# Altium project PCB_Project1.PrjPCB
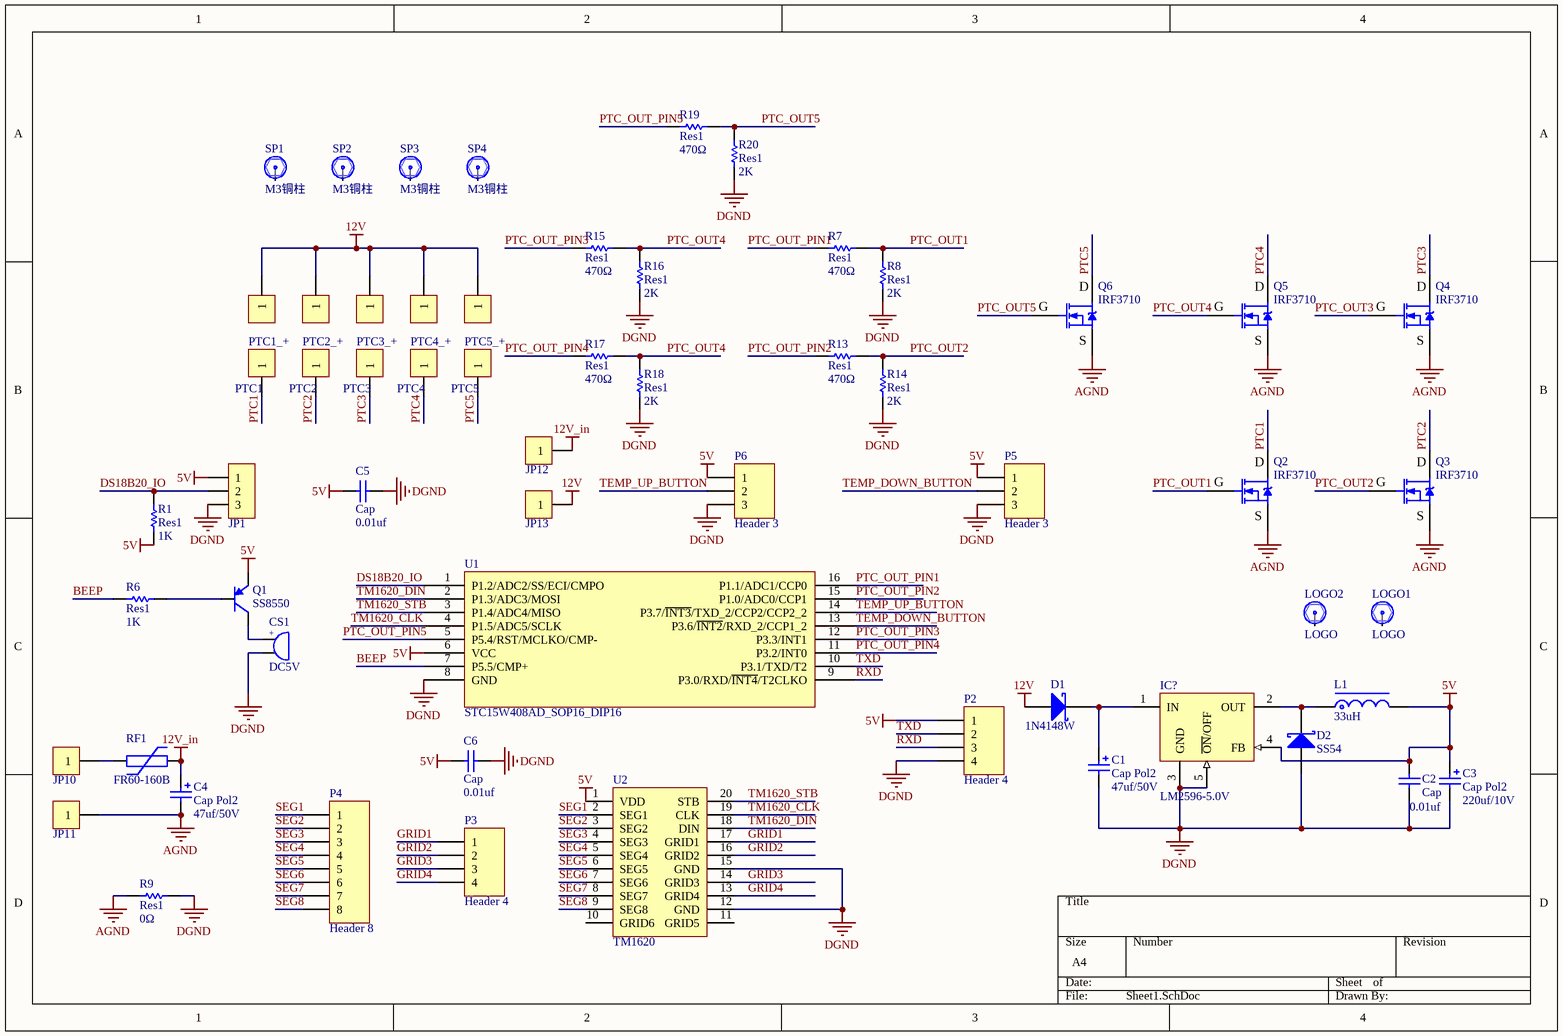
[diagram p0: Sheet1.SchDoc]
1 sheet, 59 parts. Net scope: global (net labels, ports and power ports of the same name join across sheets).
Board file: PCB1.PcbDoc

## Sheet Sheet1.SchDoc
size A4

### Parts
C1  Cap Pol2  value 47uf/50V  [CAP6.3]
C2  Cap  value 0.01uf  [0603C]
C3  Cap Pol2  value 220uf/10V  [CAP6.3]
C4  Cap Pol2  value 47uf/50V  [CAP6.3]
C5  Cap  value 0.01uf  [0603C]
C6  Cap  value 0.01uf  [0603C]
CS1  DC5V  [BEEP 5x9x5.5]
D1  1N4148W  [SOD-123]
D2  SS54  [SOD-123]
IC?  LM2596-5.0V  [TO220-5A]
JP1  HDR-1X3  [XH2.54-LI-3P]  (value not drawn)
JP10  冷压插片  [TEST 2.6]  (value not drawn)
JP11  冷压插片  [TEST 2.6]  (value not drawn)
JP12  冷压插片  [TEST 2.6]  (value not drawn)
JP13  冷压插片  [TEST 2.6]  (value not drawn)
L1  33uH  [CD104]
LOGO1  LOGO  [ICO3]
LOGO2  LOGO  [ICO1]
P2  Header 4  [XH2.54-LI-4P]
P3  Header 4  [XH2.54-LI-4P]
P4  Header 8  [XH2.54-LI-8P]
P5  Header 3  [XH2.54-LI-3P]
P6  Header 3  [XH2.54-LI-3P]
PTC1  冷压插片  [TEST 2.6]  (value not drawn)
PTC1_+  冷压插片  [TEST 2.6]  (value not drawn)
PTC2  冷压插片  [TEST 2.6]  (value not drawn)
PTC2_+  冷压插片  [TEST 2.6]  (value not drawn)
PTC3  冷压插片  [TEST 2.6]  (value not drawn)
PTC3_+  冷压插片  [TEST 2.6]  (value not drawn)
PTC4  冷压插片  [TEST 2.6]  (value not drawn)
PTC4_+  冷压插片  [TEST 2.6]  (value not drawn)
PTC5  冷压插片  [TEST 2.6]  (value not drawn)
PTC5_+  冷压插片  [TEST 2.6]  (value not drawn)
Q1  SS8550  [SOT23-3N]
Q2  IRF3710  [TO252]
Q3  IRF3710  [TO252]
Q4  IRF3710  [TO252]
Q5  IRF3710  [TO252]
Q6  IRF3710  [TO252]
R1  Res1  value 1K  [0603R]
R6  Res1  value 1K  [0603R]
R7  Res1  value 470Ω  [0603R]
R8  Res1  value 2K  [0603R]
R9  Res1  value 0Ω  [0805R]
R13  Res1  value 470Ω  [0603R]
R14  Res1  value 2K  [0603R]
R15  Res1  value 470Ω  [0603R]
R16  Res1  value 2K  [0603R]
R17  Res1  value 470Ω  [0603R]
R18  Res1  value 2K  [0603R]
R19  Res1  value 470Ω  [0603R]
R20  Res1  value 2K  [0603R]
RF1  FR60-160B  [FR60-160B]
SP1  M3铜柱  [M3x4_L]
SP2  M3铜柱  [M3x4_L]
SP3  M3铜柱  [M3x4_L]
SP4  M3铜柱  [M3x4_L]
U1  STC15W408AD_SOP16_DIP16  [SOP16]
U2  TM1620  [SOP20]

### Nets
5V: C2.2 C3.1 C5.1 C6.1 IC?.4(FB) JP1.1 L1.2 P2.1 P5.1 P6.1 Q1.2(E) R1.1 U1.6(VCC) U2.1(VDD)
12V: D1.1(A) JP13.1 PTC1_+.1 PTC2_+.1 PTC3_+.1 PTC4_+.1 PTC5_+.1
12V_in: C4.1 JP12.1 RF1.2
AGND: C4.2 JP11.1 Q2.3(S) Q3.3(S) Q4.3(S) Q5.3(S) Q6.3(S) R9.1
DGND: C1.2 C2.1 C3.2 C5.2 C6.2 CS1.2 D2.1(A) IC?.3(GND) IC?.5(~{ON}/OFF) JP1.3 P2.4 P5.3 P6.3 R8.1 R9.2 R14.1 R16.1 R18.1 R20.1 U1.8(GND) U2.12(GND) U2.15(GND)
BEEP: R6.1 U1.7(P5.5/CMP+)
DS18B20_IO: JP1.2 R1.2 U1.1(P1.2/ADC2/SS/ECI/CMPO)
GRID1: P3.1 U2.17(GRID1)
GRID2: P3.2 U2.16(GRID2)
GRID3: P3.3 U2.14(GRID3)
GRID4: P3.4 U2.13(GRID4)
PTC1: PTC1.1 Q2.2(D)
PTC2: PTC2.1 Q3.2(D)
PTC3: PTC3.1 Q4.2(D)
PTC4: PTC4.1 Q5.2(D)
PTC5: PTC5.1 Q6.2(D)
PTC_OUT1: Q2.1(G) R7.2 R8.2
PTC_OUT2: Q3.1(G) R13.2 R14.2
PTC_OUT3: Q4.1(G)
PTC_OUT4: Q5.1(G) R15.2 R16.2 R17.2 R18.2
PTC_OUT5: Q6.1(G) R19.2 R20.2
PTC_OUT_PIN1: R7.1 U1.16(P1.1/ADC1/CCP0)
PTC_OUT_PIN2: R13.1 U1.15(P1.0/ADC0/CCP1)
PTC_OUT_PIN3: R15.1 U1.12(P3.3/INT1)
PTC_OUT_PIN4: R17.1 U1.11(P3.2/INT0)
PTC_OUT_PIN5: R19.1 U1.5(P5.4/RST/MCLKO/CMP-)
RXD: P2.3 U1.9(P3.0/RXD/~{INT4}/T2CLKO)
SEG1: P4.1 U2.2(SEG1)
SEG2: P4.2 U2.3(SEG2)
SEG3: P4.3 U2.4(SEG3)
SEG4: P4.4 U2.5(SEG4)
SEG5: P4.5 U2.6(SEG5)
SEG6: P4.6 U2.7(SEG6)
SEG7: P4.7 U2.8(SEG7)
SEG8: P4.8 U2.9(SEG8)
TEMP_DOWN_BUTTON: P5.2 U1.13(P3.6/~{INT2}/RXD_2/CCP1_2)
TEMP_UP_BUTTON: P6.2 U1.14(P3.7/~{INT3}/TXD_2/CCP2/CCP2_2)
TM1620_CLK: U1.4(P1.5/ADC5/SCLK) U2.19(CLK)
TM1620_DIN: U1.2(P1.3/ADC3/MOSI) U2.18(DIN)
TM1620_STB: U1.3(P1.4/ADC4/MISO) U2.20(STB)
TXD: P2.2 U1.10(P3.1/TXD/T2)
NetC1_1: C1.1 D1.2(K) IC?.1(IN)
NetCS1_1: CS1.1 Q1.3(C)
NetD2_2: D2.2(K) IC?.2(OUT) L1.1
NetJP10_1: JP10.1 RF1.1
NetQ1_1: Q1.1(B) R6.2

Not connected (* = marked no-connect by the designer): LOGO1 1; LOGO2 1; SP1 1; SP2 1; SP3 1; SP4 1; U2 10(GRID6) 11(GRID5)

### Notes on the sheet
- (in symbol BEEP) +

### Library data of the parts
C1 C3 C4 = Cap Pol2: Polarized Capacitor (Axial); Published: 8-Jun-2000; LatestRevisionDate: 17-Jul-2002; LatestRevisionNote: Re-released for DXP Platform.; PackageReference: POLAR0.8; Publisher: Altium Limited; PackageDescription: Polarized Capacitor; 2 Leads
C2 C5 C6 = Cap: Capacitor; Published: 8-Jun-2000; LatestRevisionDate: 17-Jul-2002; LatestRevisionNote: Re-released for DXP Platform.; PackageReference: RAD-0.3; Publisher: Altium Limited; PackageDescription: Radial Cap, Thru-Hole; 2 Leads; 0.3 in Pin Spacing
CS1 = BEEP: 蜂鸣器; 版权归属: 源创客; BOM名称: 蜂鸣器; 学习资源: www.ooocke.com
D1 D2 = D Schottky: Schottky Diode; Published: 8-Jun-2000; LatestRevisionDate: 17-Jul-2002; LatestRevisionNote: Re-released for DXP Platform.; PackageReference: SMB; Publisher: Altium Limited; PackageDescription: DO-214-AA/SMB; 2 C-Bend Leads; Body 5.3 x 3.6 mm, inc. leads (LxW); Code_JEDEC: DO-214-AA
IC? = LM2596-5.0: DC降压芯片; BOM名称: DC稳压芯片; 版权归属: 源创客; 学习资源: www.ooocke.com
JP1 = Header 3: 3P接插件; 版权归属: 源创客; BOM名称: 3P接插件; 学习资源: www.ooocke.com
JP10-JP13 PTC1 PTC1_+ PTC2 PTC2_+ PTC3 PTC3_+ PTC4 PTC4_+ PTC5 PTC5_+ = 冷压插片: BOM名称: 10P接插件; 版权归属: 源创客; 学习资源: www.ooocke.com
L1 = L-CD: 贴片功率电感; BOM名称: 功率电感; 版权归属: 源创客; 学习资源: www.ooocke.com
LOGO1 LOGO2 = 铜柱加头大焊盘: 铜柱; 版权归属: 源创客; BOM名称: 铜柱; 学习资源: www.ooocke.com
P2 P3 = Header 4: Header, 4-Pin; LatestRevisionDate: 17-Jul-2002; LatestRevisionNote: Re-released for DXP Platform.; Publisher: Altium Limited
P4 = Header 8: Header, 8-Pin; LatestRevisionDate: 17-Jul-2002; LatestRevisionNote: Re-released for DXP Platform.; Publisher: Altium Limited
P5 P6 = Header 3: Header, 3-Pin; LatestRevisionDate: 17-Jul-2002; LatestRevisionNote: Re-released for DXP Platform.; Publisher: Altium Limited
Q1 = 8550-SMD: 高频放大-PNP型; 版权归属: 源创客; 属性: 40V 1.5A 1W 100MHZ; BOM名称: 高频放大-PNP型; 学习资源: www.ooocke.com
Q2-Q6 = IRF3710: N沟场效应管; 版权归属: 源创客; BOM名称: N沟场效应管; 学习资源: www.ooocke.com
R1 R6-R9 R13-R20 = Res1: Resistor; Published: 8-Jun-2000; LatestRevisionDate: 17-Jul-2002; LatestRevisionNote: Re-released for DXP Platform.; PackageReference: AXIAL-0.3; Publisher: Altium Limited; PackageDescription: Axial Device, Thru-Hole; 2 Leads; 0.3 in Pin Spacing
RF1 = PPTC: PPTC自恢复保险丝; 版权归属: 源创客; BOM名称: PPTC自恢复保险丝; 学习资源: www.ooocke.com
SP1-SP4 = 铜柱小焊盘: 铜柱; 版权归属: 源创客; BOM名称: 铜柱; 学习资源: www.ooocke.com